# Altium schematic sheet ETH-input.SchDoc: AA Design Challenge (part 2 of 3)
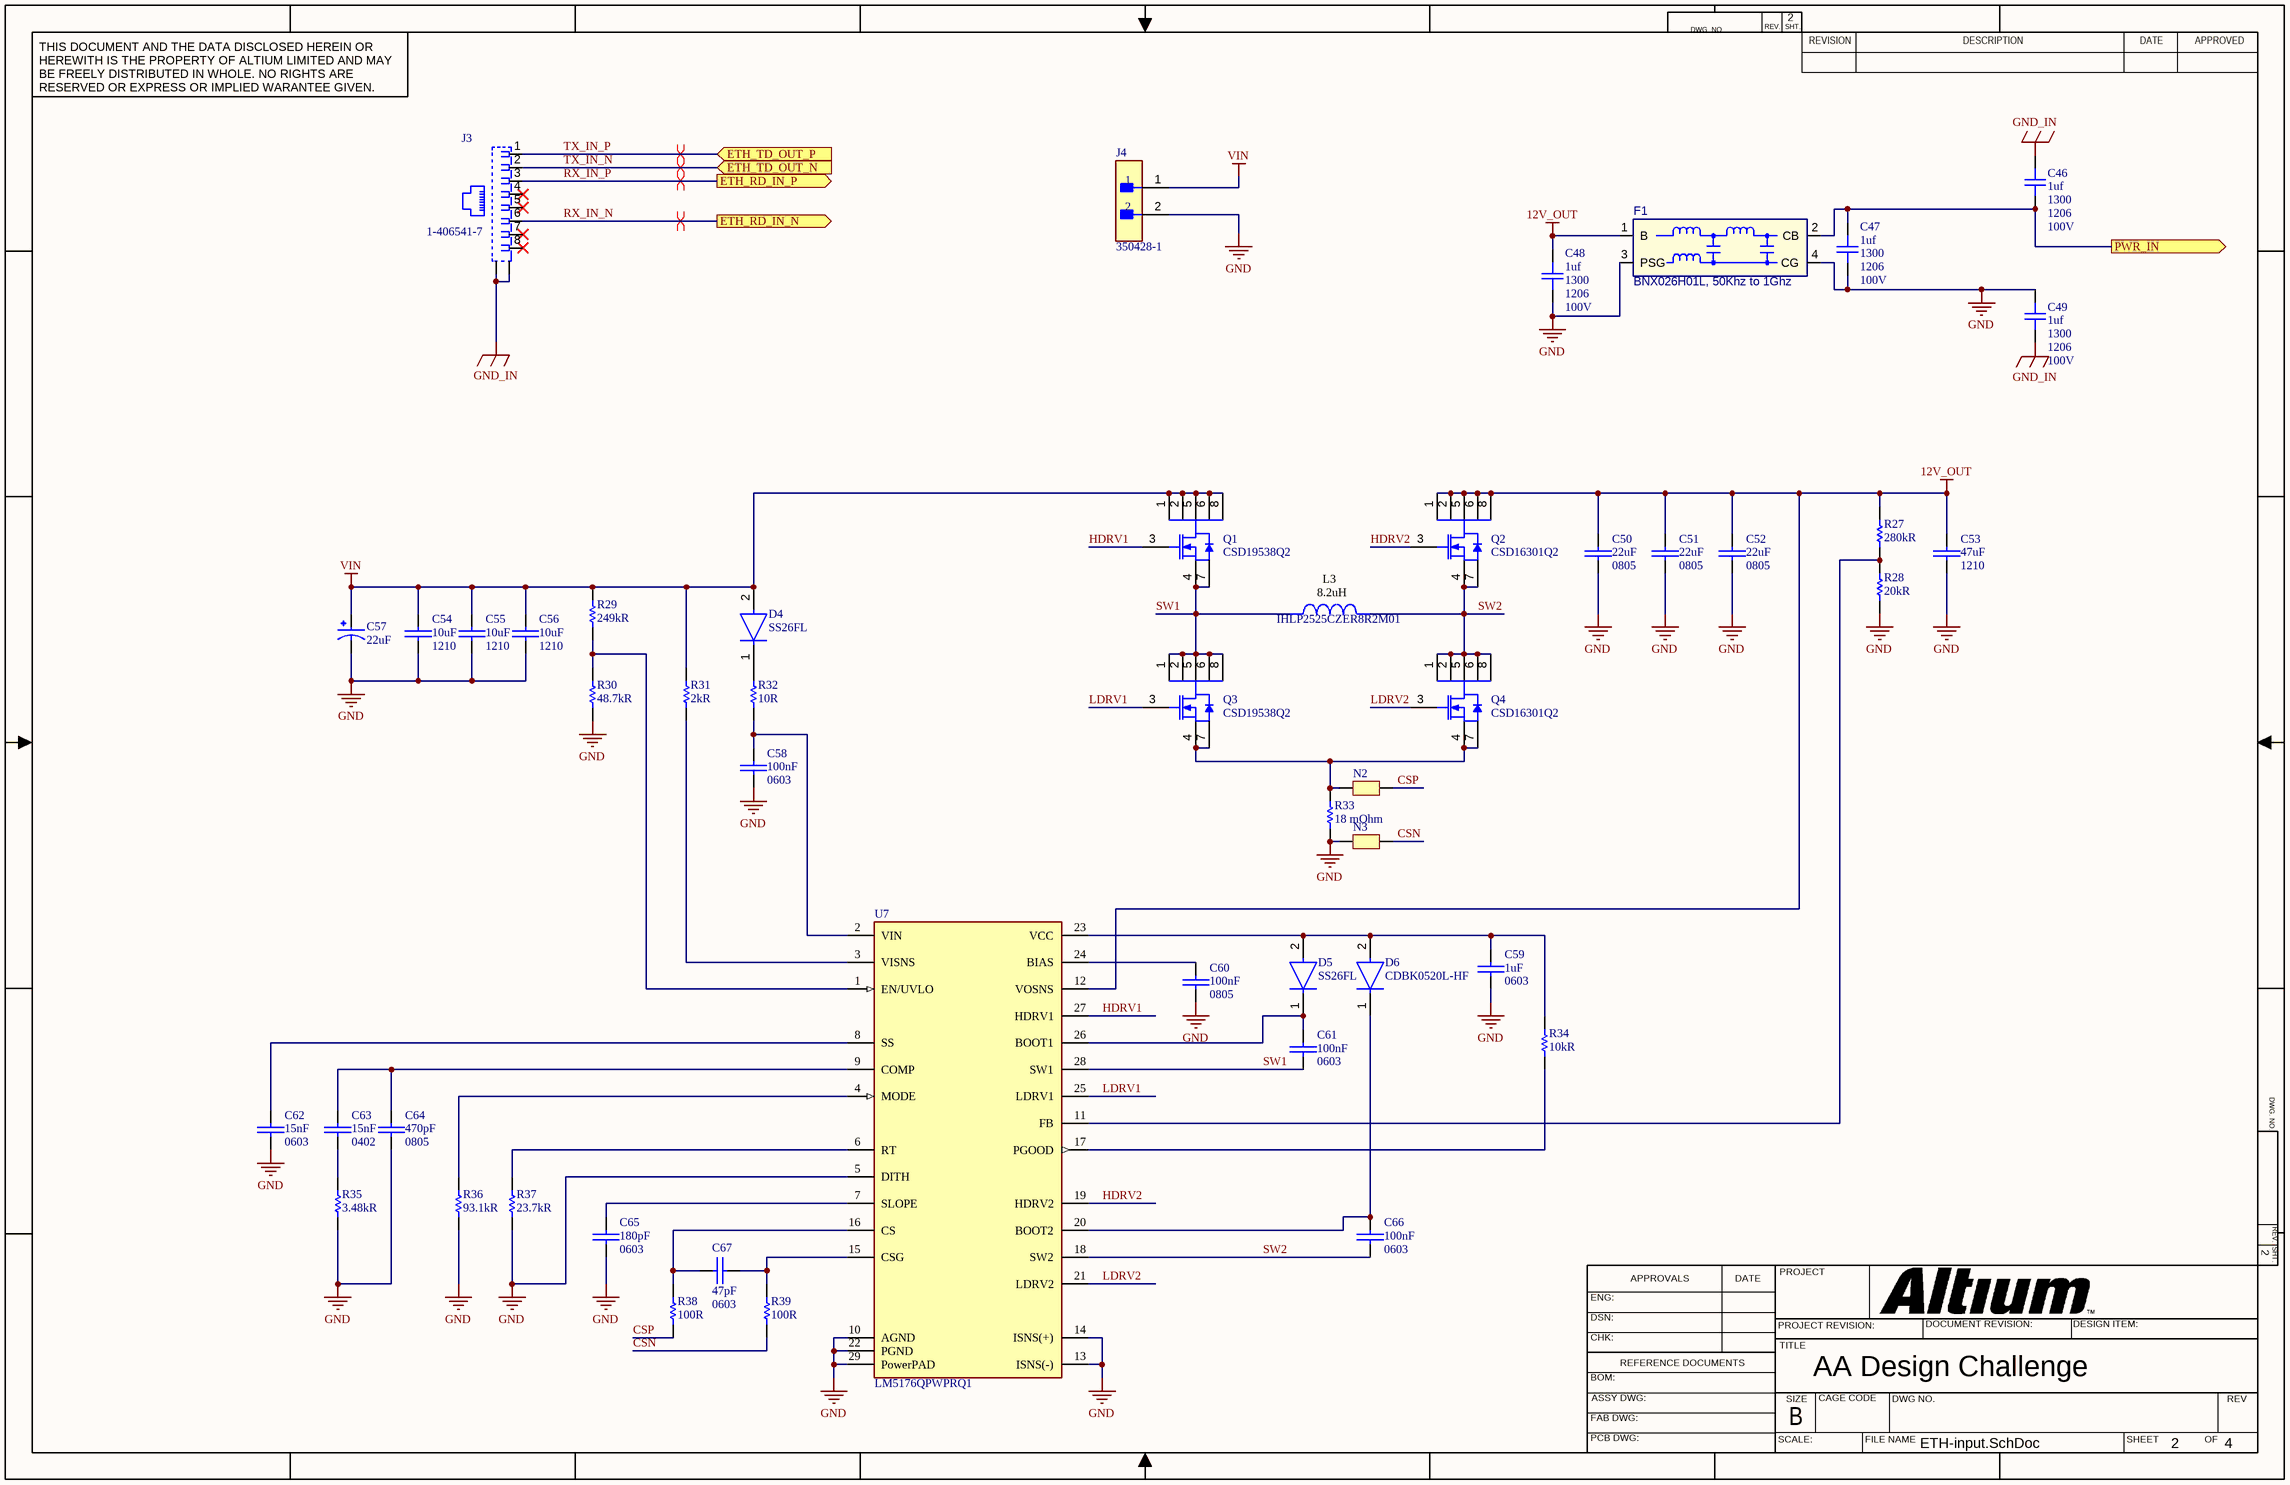
[diagram p1: ETH-input.SchDoc]
## Library data of the parts
C46-C49 = 1300: Capacitor - 1uf 100V 10% X7R 1206; Manufacturer: Samsung Electro-Mechanics; Manufacturer Part Number: CL31B105KCHNNNE; Tolerance: +/-10%; Pacstar PN: 1300; Type: Capacitor; Supplier 1: Digi-Key; Supplier Part Number 1: 1276-1838-1-ND; Supplier 2: Digi-Key; Supplier Part Number 2: 587-1777-1-ND; Supplier 3: Digi-Key; Supplier Part Number 3: 478-6226-1-ND; Status: Bronze; Checked By: xxx; Supplier 4: Arrow Electronics; Supplier 5: Mouser; Supplier Part Number 4: CL31B105KCHNNNE; Supplier Part Number 5: 187-CL31B105KCHNNNE
C50-C52 = CAP CER 10UF 63V X7R 1210: C Series 0805 22 uF 35 V ±20 % Tolerance X5R SMT Multilayer Ceramic Capacitor; Manufacturer: TDK; Manufacturer Part Number: C2012X5R1V226M125AC; Tolerance: 20%; Voltage Rating: 35V; Supplier: Digi-Key; Supplier Part Number: 445-14428-1-ND; RoHS: Yes; Category: Ceramic Capacitors; Stock: 123089; Pricing: 1=0.91000, 10=0.68900, 50=0.57260, 100=0.49310, 500=0.38178, 1000=0.32876 (USD); Mounting Technology: Surface Mount; Case Code (Metric): 2012; Case Code (Imperial): 0805; Weight: 0.000194oz; Dielectric Material: Ceramic; Min Operating Temperature: -55°C; Max Operating Temperature: 85°C; Package Quantity: 1; Packaging: Tape and Reel; Value: 22uF; Dielectric: X5R; Termination: SMD/SMT; Voltage Rating (DC): 35V; Series: C; Length: 0.079inch; Width: 0.049inch; Height: 1.25mm; Thickness: 0.057inch; Reach SVHC Compliant: No; Lead Free: Lead Free; RoHS Compliant: Yes; ComponentLink1URL: https://datasheet.ciiva.com/14893/tdkmlcccaprange-14893109.pdf?src-supplier=Digi-Key; ComponentLink1Description: https://datasheet.ciiva.com/14893/tdkmlcccaprange-14893109.pdf?src-supplier=Digi-Key; ComponentLink2URL: https://datasheet.ciiva.com/14893/tdkmlcccaprange-14893110.pdf?src-supplier=Digi-Key; ComponentLink2Description: https://datasheet.ciiva.com/14893/tdkmlcccaprange-14893110.pdf?src-supplier=Digi-Key; ComponentLink3URL: https://datasheet.ciiva.com/14893/tdkmlcccaprange-14893111.pdf?src-supplier=Digi-Key; ComponentLink3Description: https://datasheet.ciiva.com/14893/tdkmlcccaprange-14893111.pdf?src-supplier=Digi-Key
C53 = CAP CER 10UF 63V X7R 1210: 1210 47 uF 16 V ±10% Tolerance X5R SMT Multilayer Ceramic Capacitor; Manufacturer: Samsung Electro-Mechanics; Manufacturer Part Number: CL32A476KOJNNNE; Voltage Rating: 16V; Supplier: Digi-Key; Supplier Part Number: 490-6539-1-ND; RoHS: Yes; Category: Ceramic Capacitors; Stock: 395667; Pricing: 1=1.07000, 10=0.84800, 50=0.73520, 100=0.63630, 500=0.48076 (USD); Mounting Technology: Surface Mount; Pins: 2; Case Code (Metric): 3225; Case Code (Imperial): 1210; Material: Ceramic; Min Operating Temperature: -55°C; Max Operating Temperature: 85°C; Value: 47uF; Tolerance: 10%; Dielectric: X5R; Voltage Rating (DC): 16V; Packaging: Cut Tape; Package Quantity: 1; Termination: SMD/SMT; Voltage: 16V; Series: GRM; Construction: Flat; Length: 3.2mm; Width: 0.098inch; Height: 2.5mm; Thickness: 0.106inch; Depth: 2.5mm; Radiation Hardening: No; Reach SVHC Compliant: No; Lead Free: Lead Free; RoHS Compliant: Yes; ComponentLink1URL: https://datasheet.ciiva.com/6173/1747491-6173112.pdf?src-supplier=Farnell; ComponentLink1Description: https://datasheet.ciiva.com/6173/1747491-6173112.pdf?src-supplier=Farnell; ComponentLink2URL: https://datasheet.ciiva.com/6264/c02e-6264496.pdf?src-supplier=Digi-Key; ComponentLink2Description: https://datasheet.ciiva.com/6264/c02e-6264496.pdf?src-supplier=Digi-Key; ComponentLink3URL: https://datasheet.ciiva.com/5411/product-5411296.pdf?src-supplier=Mouser; ComponentLink3Description: https://datasheet.ciiva.com/5411/product-5411296.pdf?src-supplier=Mouser; ComponentLink4URL: https://datasheet.ciiva.com/29202/451184-da-01-de-vs-chip-kond-1210-47-0-uf-10pr-16-0v-x5r-29202483.pdf?src-supplier=Conrad; ComponentLink4Description: https://datasheet.ciiva.com/29202/451184-da-01-de-vs-chip-kond-1210-47-0-uf-10pr-16-0v-x5r-29202483.pdf?src-supplier=Conrad; ComponentLink5URL: https://datasheet.ciiva.com/29201/451871-da-01-de-vs-kondens-grm32-er61c-476ke15l-29201820.pdf?src-supplier=Conrad; ComponentLink5Description: https://datasheet.ciiva.com/29201/451871-da-01-de-vs-kondens-grm32-er61c-476ke15l-29201820.pdf?src-supplier=Conrad; ComponentLink6URL: https://datasheet.ciiva.com/6264/partnumbering-e-01-6264495.pdf?src-supplier=Digi-Key; ComponentLink6Description: https://datasheet.ciiva.com/6264/partnumbering-e-01-6264495.pdf?src-supplier=Digi-Key; ComponentLink7URL: https://datasheet.ciiva.com/16497/product-16497029.pdf?src-supplier=Future+Electronics; ComponentLink7Description: https://datasheet.ciiva.com/16497/product-16497029.pdf?src-supplier=Future+Electronics
C54-C56 = CAP CER 10UF 63V X7R 1210: Multilayer Ceramic Capacitors MLCC - SMD/SMT 1210 10uF 63volts *Derate Voltage/Temp; Manufacturer: Samsung Electro-Mechanics; Manufacturer Part Number: CL32B106KMVNNWE; Tolerance: 10%; Dielectric: X7R; Voltage Rating: 63V; Supplier: Digi-Key; Supplier Part Number: 1276-7053-1-ND; RoHS: Yes; Category: Ceramic Capacitors; Stock: 235653; Pricing: 1=0.88000, 10=0.66600, 50=0.55360, 100=0.47670, 500=0.36906 (USD); Mounting Technology: Surface Mount; Case Code (Metric): 3225; Material: Ceramic; Case Code (Imperial): 1210; Weight: 0.00388oz; Dielectric Material: Ceramic; Min Operating Temperature: -55°C; Max Operating Temperature: 125°C; Packaging: Tape and Reel; Voltage: 63V; Termination: SMD/SMT; Voltage Rating (DC): 63V; Package Quantity: 1000; Value: 10uF; Series: GRM; Length: 3.2mm; Width: 2.5mm; Height: 2.5mm; Thickness: 0.106inch; Depth: 2.5mm; Reach SVHC Compliant: No; Lead Free: Lead Free; RoHS Compliant: Yes; ComponentLink1URL: http://www.farnell.com/datasheets/2079202.pdf?src-supplier=Farnell; ComponentLink1Description: http://www.farnell.com/datasheets/2079202.pdf?src-supplier=Farnell; ComponentLink2URL: http://www.mouser.com/ds/2/281/c02e-2905.pdf?src-supplier=Mouser; ComponentLink2Description: http://www.mouser.com/ds/2/281/c02e-2905.pdf?src-supplier=Mouser; ComponentLink3URL: http://www.farnell.com/datasheets/2079202.pdf?src-supplier=Element14; ComponentLink3Description: http://www.farnell.com/datasheets/2079202.pdf?src-supplier=Element14; ComponentLink4URL: http://search.murata.co.jp/Ceramy/image/img/A01X/G101/ENG/GRM32ER71J106KA12-01.pdf?src-supplier=Digi-Key; ComponentLink4Description: http://search.murata.co.jp/Ceramy/image/img/A01X/G101/ENG/GRM32ER71J106KA12-01.pdf?src-supplier=Digi-Key; ComponentLink5URL: http://www.farnell.com/datasheets/2079202.pdf?src-supplier=Newark; ComponentLink5Description: http://www.farnell.com/datasheets/2079202.pdf?src-supplier=Newark; ComponentLink6URL: http://psearch.en.murata.com/capacitor/product/GRM32ER71J106KA12%23.pdf?src-supplier=Avnet; ComponentLink6Description: http://psearch.en.murata.com/capacitor/product/GRM32ER71J106KA12%23.pdf?src-supplier=Avnet
C57 = EEEHC1H220XP: 22ÂµF 50V Aluminum Electrolytic Capacitors Radial, Can - SMD 3000 Hrs @ 105Â°C; Manufacturer: Panasonic; Package: RADIAL-2 Panasonic; Price: None; Value: *; SnapEDA_Link: https://www.snapeda.com/parts/EEEHC1H220XP/Panasonic/view-part/?ref=snap; Manufacturer Part Number: EEEHC1H220XP; Availability: Not in stock; Check_prices: https://www.snapeda.com/parts/EEEHC1H220XP/Panasonic/view-part/?ref=eda
C58 = CAP CER 10UF 63V X7R 1210: CGA Series 0603 100 nF 50 V ±10 % Tolerance X7R SMT Multilayer Ceramic Capacitor; Manufacturer: TDK; Manufacturer Part Number: CGA3E2X7R1H104K080AA; Tolerance: 10%; Voltage Rating (DC): 50V; Supplier: Digi-Key; Supplier Part Number: 445-5666-1-ND; RoHS: Yes; Category: Ceramic Capacitors; Stock: 7571751; Pricing: 1=0.10000, 10=0.06700, 50=0.03640, 100=0.02970, 500=0.02120, 1000=0.01666 (USD); Mounting Technology: Surface Mount; Case Code (Imperial): 0603; Case Code (Metric): 1608; Weight: 7.1E-05oz; Min Operating Temperature: -55°C; Max Operating Temperature: 125°C; Value: 100nF; Packaging: Tape and Reel; Dielectric: X7R; Package Quantity: 1; Voltage Rating: 50V; Termination: SMD/SMT; Voltage: 50V; Series: CGA; Length: 1.6mm; Width: 0.031inch; Height: 0.8mm; Depth: 0.8mm; Thickness: 0.035inch; Ratings: AEC-Q200; Radiation Hardening: No; Lead Free: Lead Free; RoHS Compliant: Yes; Reach SVHC Compliant: No; ComponentLink1URL: https://datasheet.ciiva.com/24216/cga3e2x7r1h104k080aa-266291-24216208.pdf?src-supplier=Mouser; ComponentLink1Description: https://datasheet.ciiva.com/24216/cga3e2x7r1h104k080aa-266291-24216208.pdf?src-supplier=Mouser; ComponentLink2URL: https://datasheet.ciiva.com/15192/getdatasheetpartid-715867-15192412.pdf?src-supplier=Verical; ComponentLink2Description: https://datasheet.ciiva.com/15192/getdatasheetpartid-715867-15192412.pdf?src-supplier=Verical; ComponentLink3URL: https://datasheet.ciiva.com/23803/1936565-23803084.pdf?src-supplier=Newark; ComponentLink3Description: https://datasheet.ciiva.com/23803/1936565-23803084.pdf?src-supplier=Newark; ComponentLink4URL: https://datasheet.ciiva.com/22725/1735392-22725642.pdf?src-supplier=Element14; ComponentLink4Description: https://datasheet.ciiva.com/22725/1735392-22725642.pdf?src-supplier=Element14; ComponentLink5URL: https://datasheet.ciiva.com/46385/1735392-46385708.pdf?src-supplier=Element14; ComponentLink5Description: https://datasheet.ciiva.com/46385/1735392-46385708.pdf?src-supplier=Element14; ComponentLink6URL: https://datasheet.ciiva.com/16500/mlccspec-automotive-general-midvoltage-en-16500693.pdf?src-supplier=Future+Electronics; ComponentLink6Description: https://datasheet.ciiva.com/16500/mlccspec-automotive-general-midvoltage-en-16500693.pdf?src-supplier=Future+Electronics
C59 = CAP CER 10UF 63V X7R 1210: 0603 1 uF 16 V ±10% Tolerance X7R SMT Multilayer Ceramic Capacitor; Manufacturer: Samsung Electro-Mechanics; Manufacturer Part Number: CL10B105KO8NNNC; Voltage Rating: 16V; Supplier: Digi-Key; Supplier Part Number: 587-1241-1-ND; RoHS: Yes; Category: Ceramic Capacitors; Stock: 2153377; Pricing: 1=0.10000, 10=0.07000, 50=0.03820, 100=0.03120, 500=0.02228, 1000=0.01750 (USD); Mounting Technology: Surface Mount; Pins: 2; Case Code (Metric): 1608; Case Code (Imperial): 0603; Min Operating Temperature: -55°C; Max Operating Temperature: 125°C; Package Quantity: 1; Value: 1uF; Tolerance: 10%; Packaging: Tape and Reel; Voltage Rating (DC): 16V; Dielectric: X7R; Termination: SMD/SMT; Series: M; Construction: Flat; Length: 1.6mm; Width: 0.031inch; Height: 0.8mm; Thickness: 0.035inch; Depth: 0.8mm; Radiation Hardening: No; Lead Free: Lead Free; RoHS Compliant: Yes; Reach SVHC Compliant: No; Halogen Free: Halogen Free; ComponentLink1URL: https://datasheet.ciiva.com/5815/1697718-5815968.pdf?src-supplier=Farnell; ComponentLink1Description: https://datasheet.ciiva.com/5815/1697718-5815968.pdf?src-supplier=Farnell; ComponentLink2URL: https://datasheet.ciiva.com/132/emk107b7105ka-t-ss-132544.pdf?src-supplier=Digi-Key; ComponentLink2Description: https://datasheet.ciiva.com/132/emk107b7105ka-t-ss-132544.pdf?src-supplier=Digi-Key; ComponentLink3URL: https://datasheet.ciiva.com/30212/193emk107b7105ka-t-30212019.pdf?src-supplier=Onlinecomponents.com; ComponentLink3Description: https://datasheet.ciiva.com/30212/193emk107b7105ka-t-30212019.pdf?src-supplier=Onlinecomponents.com; ComponentLink4URL: https://datasheet.ciiva.com/15920/966emk107b7105ka-t-15920470.pdf?src-supplier=Onlinecomponents.com; ComponentLink4Description: https://datasheet.ciiva.com/15920/966emk107b7105ka-t-15920470.pdf?src-supplier=Onlinecomponents.com; ComponentLink5URL: https://datasheet.ciiva.com/26871/getdatasheetpartid-637486-26871306.pdf?src-supplier=Verical; ComponentLink5Description: https://datasheet.ciiva.com/26871/getdatasheetpartid-637486-26871306.pdf?src-supplier=Verical; ComponentLink6URL: https://datasheet.ciiva.com/30137/126emk107b7105ka-t-30137199.pdf?src-supplier=Onlinecomponents.com; ComponentLink6Description: https://datasheet.ciiva.com/30137/126emk107b7105ka-t-30137199.pdf?src-supplier=Onlinecomponents.com; ComponentLink7URL: https://datasheet.ciiva.com/7975/746258-7975612.pdf?src-supplier=Element14; ComponentLink7Description: https://datasheet.ciiva.com/7975/746258-7975612.pdf?src-supplier=Element14; ComponentLink8URL: https://datasheet.ciiva.com/7657/1697718-7657322.pdf?src-supplier=Element14; ComponentLink8Description: https://datasheet.ciiva.com/7657/1697718-7657322.pdf?src-supplier=Element14
C60 = CAP CER 10UF 63V X7R 1210: 0805 100 nF 25V ±10 % Tolerance X7R Surface Mount Multilayer Ceramic Capacitor; Manufacturer: Kyocera AVX; Manufacturer Part Number: 08053C104KAT2A; Tolerance: 10%; Insulation Resistance: 100GR; Dissipation Factor: 3%; Supplier: Digi-Key; Supplier Part Number: 478-3755-1-ND; RoHS: Yes; Category: Ceramic Capacitors; Stock: 793433; Pricing: 1=0.10000, 10=0.06100, 50=0.03340, 100=0.02730, 500=0.01948, 1000=0.01530 (USD); Mounting Technology: Surface Mount,PCB; Pins: 2; Case Code (Imperial): 0805; Case Code (Metric): 2012; Min Operating Temperature: -55°C; Max Operating Temperature: 125°C; Value: 100nF; Dielectric: X7R; Packaging: Tape and Reel; Voltage Rating (DC): 25V; Voltage: 25V; Voltage Rating: 25V; Package Quantity: 4000; Termination: SMD/SMT; Series: -; Construction: Flat; Length: 2.01mm; Width: 0.008inch; Height: 0.94mm; Depth: 1.25mm; Thickness: 0.037inch; Radiation Hardening: No; Reach SVHC Compliant: No; Lead Free: Lead Free; RoHS Compliant: Yes; ComponentLink1URL: https://datasheet.ciiva.com/11786/0900766b80ed4be2-11786193.pdf?src-supplier=Rs; ComponentLink1Description: https://datasheet.ciiva.com/11786/0900766b80ed4be2-11786193.pdf?src-supplier=Rs; ComponentLink2URL: https://datasheet.ciiva.com/150/cx7r-150317.pdf?src-supplier=Digi-Key; ComponentLink2Description: https://datasheet.ciiva.com/150/cx7r-150317.pdf?src-supplier=Digi-Key; ComponentLink3URL: https://datasheet.ciiva.com/150/cx7r-150318.pdf?src-supplier=Digi-Key; ComponentLink3Description: https://datasheet.ciiva.com/150/cx7r-150318.pdf?src-supplier=Digi-Key; ComponentLink4URL: https://datasheet.ciiva.com/150/cx7r-150319.pdf?src-supplier=Digi-Key; ComponentLink4Description: https://datasheet.ciiva.com/150/cx7r-150319.pdf?src-supplier=Digi-Key; ComponentLink5URL: https://datasheet.ciiva.com/11462/cx7r-11462779.pdf?src-supplier=Avnet; ComponentLink5Description: https://datasheet.ciiva.com/11462/cx7r-11462779.pdf?src-supplier=Avnet; ComponentLink6URL: https://datasheet.ciiva.com/5416/cx7r-5416971.pdf?src-supplier=Mouser; ComponentLink6Description: https://datasheet.ciiva.com/5416/cx7r-5416971.pdf?src-supplier=Mouser; ComponentLink7URL: https://datasheet.ciiva.com/2987/cx7r-2987955.pdf?src-supplier=Avnet; ComponentLink7Description: https://datasheet.ciiva.com/2987/cx7r-2987955.pdf?src-supplier=Avnet; ComponentLink8URL: https://datasheet.ciiva.com/14596/70001075-14596006.pdf?src-supplier=Allied+Electronics; ComponentLink8Description: https://datasheet.ciiva.com/14596/70001075-14596006.pdf?src-supplier=Allied+Electronics; ComponentLink9URL: https://datasheet.ciiva.com/7811/cx7r-7811991.pdf?src-supplier=Element14; ComponentLink9Description: https://datasheet.ciiva.com/7811/cx7r-7811991.pdf?src-supplier=Element14; ComponentLink10URL: https://datasheet.ciiva.com/7811/cx7r-7811992.pdf?src-supplier=Element14; ComponentLink10Description: https://datasheet.ciiva.com/7811/cx7r-7811992.pdf?src-supplier=Element14; ComponentLink11URL: https://datasheet.ciiva.com/7811/cx7r-7811990.pdf?src-supplier=Element14; ComponentLink11Description: https://datasheet.ciiva.com/7811/cx7r-7811990.pdf?src-supplier=Element14
C61 C66 = CAP CER 10UF 63V X7R 1210: Cap Ceramic 0.1uF 25V X7R 10% SMD 0603 125 Paper T/R; Manufacturer: Kyocera AVX; Manufacturer Part Number: 06033C104KAT2A; Supplier: Digi-Key; Supplier Part Number: 478-3714-1-ND; RoHS: Yes; Category: Ceramic Capacitors; Stock: 1816230; Pricing: 1=0.10000, 10=0.03900, 50=0.02120, 100=0.01730, 500=0.01238, 1000=0.00972 (USD); Mounting Technology: Surface Mount,PCB; Pins: 2; Case Code (Metric): 1608; Case Code (Imperial): 0603; Min Operating Temperature: -55°C; Max Operating Temperature: 125°C; Tolerance: 10%; Value: 100nF; Dielectric: X7R; Packaging: Tape and Reel; Voltage Rating (DC): 25V; Voltage: 25V; Voltage Rating: 25V; Package Quantity: 4000; Termination: SMD/SMT; Series: -; Construction: Flat; Length: 1.6mm; Width: 0.81mm; Height: 0.9mm; Depth: 0.81mm; Reach SVHC Compliant: No; Lead Free: Lead Free; RoHS Compliant: Yes; ComponentLink1URL: https://datasheet.ciiva.com/36526/1929031-36526214.pdf?src-supplier=Jameco; ComponentLink1Description: https://datasheet.ciiva.com/36526/1929031-36526214.pdf?src-supplier=Jameco; ComponentLink2URL: https://datasheet.ciiva.com/16199/cx7r-16199096.pdf?src-supplier=Future+Electronics; ComponentLink2Description: https://datasheet.ciiva.com/16199/cx7r-16199096.pdf?src-supplier=Future+Electronics; ComponentLink3URL: https://datasheet.ciiva.com/7855/cx7r-7855214.pdf?src-supplier=Element14; ComponentLink3Description: https://datasheet.ciiva.com/7855/cx7r-7855214.pdf?src-supplier=Element14; ComponentLink4URL: https://datasheet.ciiva.com/7855/1679506-7855046.pdf?src-supplier=Element14; ComponentLink4Description: https://datasheet.ciiva.com/7855/1679506-7855046.pdf?src-supplier=Element14; ComponentLink5URL: https://datasheet.ciiva.com/152/cx7r-152389.pdf?src-supplier=Digi-Key; ComponentLink5Description: https://datasheet.ciiva.com/152/cx7r-152389.pdf?src-supplier=Digi-Key; ComponentLink6URL: https://datasheet.ciiva.com/152/cx7r-152388.pdf?src-supplier=Digi-Key; ComponentLink6Description: https://datasheet.ciiva.com/152/cx7r-152388.pdf?src-supplier=Digi-Key; ComponentLink7URL: https://datasheet.ciiva.com/152/cx7r-152390.pdf?src-supplier=Digi-Key; ComponentLink7Description: https://datasheet.ciiva.com/152/cx7r-152390.pdf?src-supplier=Digi-Key; ComponentLink8URL: https://datasheet.ciiva.com/14590/70001075-14590200.pdf?src-supplier=Allied+Electronics; ComponentLink8Description: https://datasheet.ciiva.com/14590/70001075-14590200.pdf?src-supplier=Allied+Electronics; ComponentLink9URL: https://datasheet.ciiva.com/14598/70001075-14598246.pdf?src-supplier=Allied+Electronics; ComponentLink9Description: https://datasheet.ciiva.com/14598/70001075-14598246.pdf?src-supplier=Allied+Electronics
C62 = CAP CER 10UF 63V X7R 1210: 0603 C 15nF Ceramic Multilayer Capacitor; 25 V; +125degC; C0G Dielectric; +/-5%; Manufacturer: KEMET; Manufacturer Part Number: C0603C153J3GACTU; Tolerance: 5%; Voltage Rating: 25V; Temperature Coefficient: 30ppm/°C; Dissipation Factor: 0.1%; Supplier: Digi-Key; Supplier Part Number: 399-C0603C153J3GAC7867CT-ND; RoHS: Yes; Category: Ceramic Capacitors; Stock: 13854; Pricing: 1=0.38000, 10=0.26500, 50=0.18560, 100=0.15910, 500=0.11930, 1000=0.10075 (USD); Mounting Technology: Surface Mount; Pins: 2; Case Code (Metric): 1608; Case Code (Imperial): 0603; Dielectric Material: Ceramic; Min Operating Temperature: -55°C; Max Operating Temperature: 125°C; Value: 15nF; Packaging: Tape and Reel; Package Quantity: 1; Voltage Rating (DC): 25V; Dielectric: C0G; Termination: SMD/SMT; Voltage: 25V; Series: C; Construction: Flat; Length: 1.6mm; Width: 0.8mm; Height: 0.8mm; Thickness: 0.034inch; Depth: 0.8mm; Radiation Hardening: No; Reach SVHC Compliant: No; Lead Free: Lead Free; RoHS Compliant: Yes; ComponentLink1URL: https://datasheet.ciiva.com/5423/kem-c1003-c0g-smd-356956-5423902.pdf?src-supplier=Mouser; ComponentLink1Description: https://datasheet.ciiva.com/5423/kem-c1003-c0g-smd-356956-5423902.pdf?src-supplier=Mouser; ComponentLink2URL: https://datasheet.ciiva.com/11664/kem-c1003-c0g-smd-11664299.pdf?src-supplier=Avnet; ComponentLink2Description: https://datasheet.ciiva.com/11664/kem-c1003-c0g-smd-11664299.pdf?src-supplier=Avnet; ComponentLink3URL: https://datasheet.ciiva.com/7823/10895-7823644.pdf?src-supplier=Element14; ComponentLink3Description: https://datasheet.ciiva.com/7823/10895-7823644.pdf?src-supplier=Element14; ComponentLink4URL: https://datasheet.ciiva.com/7823/10895-7823645.pdf?src-supplier=Element14; ComponentLink4Description: https://datasheet.ciiva.com/7823/10895-7823645.pdf?src-supplier=Element14
C63 = CAP CER 10UF 63V X7R 1210: Cap Ceramic 0.015uF 50V X7R 10% SMD 0402 125°C Punched Paper T/R; Manufacturer: TDK; Manufacturer Part Number: CGA2B3X7R1H153K050BB; Supplier: Digi-Key; Supplier Part Number: 445-6894-1-ND; RoHS: Yes; Category: Ceramic Capacitors; Stock: 5055; Pricing: 1=0.10000, 10=0.06700, 50=0.03640, 100=0.02970, 500=0.02120, 1000=0.01666, 2500=0.01515, 5000=0.01394 (USD); Mounting Technology: Surface Mount; Case Code (Metric): 1005; Case Code (Imperial): 0402; Weight: 2.3E-05oz; Min Operating Temperature: -55°C; Max Operating Temperature: 125°C; Value: 15nF; Tolerance: 10%; Voltage Rating: 50V; Packaging: Tape and Reel; Dielectric: X7R; Termination: SMD/SMT; Series: CGA; Package Quantity: 10000; Voltage Rating (DC): 50V; Length: 1mm; Width: 0.5mm; Height: 0.5mm; Depth: 0.5mm; Ratings: AEC-Q200; RoHS Compliant: Yes; Reach SVHC Compliant: No; ComponentLink1URL: https://datasheet.ciiva.com/24216/cga2b3x7r1h153k050bb-265753-24216936.pdf?src-supplier=Mouser; ComponentLink1Description: https://datasheet.ciiva.com/24216/cga2b3x7r1h153k050bb-265753-24216936.pdf?src-supplier=Mouser; ComponentLink2URL: https://datasheet.ciiva.com/7975/1807242-7975309.pdf?src-supplier=Element14; ComponentLink2Description: https://datasheet.ciiva.com/7975/1807242-7975309.pdf?src-supplier=Element14
C64 = CAP CER 10UF 63V X7R 1210: CAP CER 470PF 50V C0G/NP0 0805; Manufacturer: Wurth Elektronik; Manufacturer Part Number: 885012007061; Material: Ceramic; Tolerance: 5%; Dielectric: C0G; Temperature Coefficient: 300ppm/°C; Supplier: Digi-Key; Supplier Part Number: 1276-1121-1-ND; RoHS: Yes; Category: Ceramic Capacitors; Stock: 2; Pricing: 1=0.10000 (USD); Mounting Technology: Surface Mount; Case Code (Metric): 2012; Case Code (Imperial): 0805; Min Operating Temperature: -55°C; Max Operating Temperature: 125°C; Package Quantity: 1; Packaging: Tape and Reel; Value: 470pF; Voltage Rating: 50V; Voltage: 50V; Series: CL; Voltage Rating (DC): 50V; Length: 2mm; Width: 0.049inch; Height: 0.65mm; Thickness: 0.03inch; Depth: 1.25mm; Radiation Hardening: No; RoHS Compliant: Yes; Lead Free: Lead Free; ComponentLink1URL: https://datasheet.ciiva.com/25800/cl21c471jbannnc-25800432.pdf?src-supplier=Digi-Key; ComponentLink1Description: https://datasheet.ciiva.com/25800/cl21c471jbannnc-25800432.pdf?src-supplier=Digi-Key; ComponentLink2URL: https://datasheet.ciiva.com/26838/getdatasheetpartid-481551-26838808.pdf?src-supplier=Verical; ComponentLink2Description: https://datasheet.ciiva.com/26838/getdatasheetpartid-481551-26838808.pdf?src-supplier=Verical; ComponentLink3URL: https://datasheet.ciiva.com/29200/453567-da-01-en-vs-kondensator-0805-29200120.pdf?src-supplier=Conrad; ComponentLink3Description: https://datasheet.ciiva.com/29200/453567-da-01-en-vs-kondensator-0805-29200120.pdf?src-supplier=Conrad; ComponentLink4URL: https://datasheet.ciiva.com/26310/mlcc-catalogdownload2013-eng-26310239.pdf?src-supplier=Distrelec; ComponentLink4Description: https://datasheet.ciiva.com/26310/mlcc-catalogdownload2013-eng-26310239.pdf?src-supplier=Distrelec; ComponentLink5URL: https://datasheet.ciiva.com/16393/cl05b104kq5nnnc-16393422.pdf?src-supplier=Future+Electronics; ComponentLink5Description: https://datasheet.ciiva.com/16393/cl05b104kq5nnnc-16393422.pdf?src-supplier=Future+Electronics
C65 = CAP CER 10UF 63V X7R 1210: Surface Mount Ceramic Multilayer Capacitor 180pF 5% C0G 50V 0603 Paper T/R; Manufacturer: Yageo; Manufacturer Part Number: CC0603JRNPO9BN181; Insulation Resistance: 100GR; Supplier: Digi-Key; Supplier Part Number: 311-1072-1-ND; RoHS: Yes; Category: Ceramic Capacitors; Stock: 299906; Pricing: 1=0.10000, 10=0.05500, 50=0.02980, 100=0.02430, 500=0.01740, 1000=0.01367 (USD); Mounting Technology: Surface Mount; Material: Ceramic; Dielectric Material: Ceramic; Case Code (Metric): 1608; Case Code (Imperial): 0603; Min Operating Temperature: -55°C; Max Operating Temperature: 125°C; Value: 180pF; Tolerance: 5%; Dielectric: C0G; Packaging: Tape and Reel; Voltage Rating (DC): 50V; Package Quantity: 1; Termination: SMD/SMT; Series: CC; Voltage Rating: 50V; Length: 1.6mm; Width: 0.031inch; Height: 0.8mm; Thickness: 0.035inch; Depth: 0.8mm; Radiation Hardening: No; Lead Free: Lead Free; RoHS Compliant: Yes; Reach SVHC Compliant: Unknown; ComponentLink1URL: https://datasheet.ciiva.com/7978/1132289-7978133.pdf?src-supplier=Element14; ComponentLink1Description: https://datasheet.ciiva.com/7978/1132289-7978133.pdf?src-supplier=Element14; ComponentLink2URL: https://datasheet.ciiva.com/8033/1443161-8033736.pdf?src-supplier=Element14; ComponentLink2Description: https://datasheet.ciiva.com/8033/1443161-8033736.pdf?src-supplier=Element14; ComponentLink3URL: https://datasheet.ciiva.com/8033/1443161-8033738.pdf?src-supplier=Element14; ComponentLink3Description: https://datasheet.ciiva.com/8033/1443161-8033738.pdf?src-supplier=Element14; ComponentLink4URL: https://datasheet.ciiva.com/176/mlccorderingcode-176406.pdf?src-supplier=Digi-Key; ComponentLink4Description: https://datasheet.ciiva.com/176/mlccorderingcode-176406.pdf?src-supplier=Digi-Key; ComponentLink5URL: https://datasheet.ciiva.com/176/mlccorderingcode-176405.pdf?src-supplier=Digi-Key; ComponentLink5Description: https://datasheet.ciiva.com/176/mlccorderingcode-176405.pdf?src-supplier=Digi-Key; ComponentLink6URL: https://datasheet.ciiva.com/176/mlccorderingcode-176407.pdf?src-supplier=Digi-Key; ComponentLink6Description: https://datasheet.ciiva.com/176/mlccorderingcode-176407.pdf?src-supplier=Digi-Key; ComponentLink7URL: https://datasheet.ciiva.com/5427/upy-gp-np0-16v-to-50v-8-5427755.pdf?src-supplier=Mouser; ComponentLink7Description: https://datasheet.ciiva.com/5427/upy-gp-np0-16v-to-50v-8-5427755.pdf?src-supplier=Mouser; ComponentLink8URL: https://datasheet.ciiva.com/26862/getdatasheetpartid-403527-26862762.pdf?src-supplier=Verical; ComponentLink8Description: https://datasheet.ciiva.com/26862/getdatasheetpartid-403527-26862762.pdf?src-supplier=Verical
C67 = CAP CER 10UF 63V X7R 1210: 0603 47 pF 50 V ±5% Tolerance C0G/NP0 Surface Mount Multilayer Ceramic Capacitor; Manufacturer: Kyocera AVX; Manufacturer Part Number: 06035A470JAT2A; Dielectric: C0G; Voltage Rating (DC): 50V; Temperature Coefficient: 30ppm/°C; Supplier: Digi-Key; Supplier Part Number: 478-1171-1-ND; RoHS: Yes; Category: Ceramic Capacitors; Stock: 359855; Pricing: 1=0.10000, 10=0.04900, 50=0.02660, 100=0.02180, 500=0.01556, 1000=0.01222 (USD); Mounting Technology: Surface Mount; Pins: 2; Case Code (Metric): 1608; Case Code (Imperial): 0603; Min Operating Temperature: -55°C; Max Operating Temperature: 125°C; Tolerance: 5%; Value: 47pF; Packaging: Tape and Reel; Voltage: 50V; Voltage Rating: 50V; Termination: SMD/SMT; Series: -; Length: 1.6mm; Width: 0.8mm; Height: 0.9mm; Depth: 0.81mm; Reach SVHC Compliant: No; Lead Free: Lead Free; RoHS Compliant: Yes; ComponentLink1URL: https://datasheet.ciiva.com/11786/0900766b802d4697-11786631.pdf?src-supplier=Rs; ComponentLink1Description: https://datasheet.ciiva.com/11786/0900766b802d4697-11786631.pdf?src-supplier=Rs; ComponentLink2URL: https://datasheet.ciiva.com/16327/ccog-16327110.pdf?src-supplier=Future+Electronics; ComponentLink2Description: https://datasheet.ciiva.com/16327/ccog-16327110.pdf?src-supplier=Future+Electronics; ComponentLink3URL: https://datasheet.ciiva.com/2987/ccog-2987803.pdf?src-supplier=Avnet; ComponentLink3Description: https://datasheet.ciiva.com/2987/ccog-2987803.pdf?src-supplier=Avnet; ComponentLink4URL: https://datasheet.ciiva.com/7855/759117-7855071.pdf?src-supplier=Element14; ComponentLink4Description: https://datasheet.ciiva.com/7855/759117-7855071.pdf?src-supplier=Element14; ComponentLink5URL: https://datasheet.ciiva.com/150/ccog-150297.pdf?src-supplier=Digi-Key; ComponentLink5Description: https://datasheet.ciiva.com/150/ccog-150297.pdf?src-supplier=Digi-Key; ComponentLink6URL: https://datasheet.ciiva.com/150/ccog-150296.pdf?src-supplier=Digi-Key; ComponentLink6Description: https://datasheet.ciiva.com/150/ccog-150296.pdf?src-supplier=Digi-Key; ComponentLink7URL: https://datasheet.ciiva.com/150/ccog-150298.pdf?src-supplier=Digi-Key; ComponentLink7Description: https://datasheet.ciiva.com/150/ccog-150298.pdf?src-supplier=Digi-Key; ComponentLink8URL: https://datasheet.ciiva.com/1124/759117-1124785.pdf?src-supplier=Element14; ComponentLink8Description: https://datasheet.ciiva.com/1124/759117-1124785.pdf?src-supplier=Element14; ComponentLink9URL: https://datasheet.ciiva.com/1124/759117-1124784.pdf?src-supplier=Element14; ComponentLink9Description: https://datasheet.ciiva.com/1124/759117-1124784.pdf?src-supplier=Element14
D4 D5 = d7152d700b627762746794eb795d46e: DIODE SCHOTTKY 60V 2A SOD123F; Manufacturer: ON Semiconductor / Fairchild; Reverse Recovery Time: 8.26ns; Element Configuration: Single; Max Forward Surge Current (Ifsm): 50A; Supplier: Digi-Key; Supplier Part Number: SS26FLCT-ND; Manufacturer Part Number: SS26FL; RoHS: Yes; Category: Schottky Diodes; Stock: 57278; Pricing: 1=0.47000, 10=0.35600, 100=0.22200, 500=0.15190, 1000=0.11684 (USD); Mounting Technology: Surface Mount; Case/Package: SOD; Weight: 0.0276g; Packaging: Cut Tape; Average Rectified Current: 2A; Max Repetitive Reverse Voltage (Vrrm): 60V; Max Reverse Voltage (DC): 60V; Series: Automotive, AEC-Q101; RoHS Compliant: Yes; ComponentLink1URL: http://www.farnell.com/datasheets/2552652.pdf?src-supplier=Farnell; ComponentLink1Description: http://www.farnell.com/datasheets/2552652.pdf?src-supplier=Farnell; ComponentLink2URL: http://www.farnell.com/datasheets/2552652.pdf?src-supplier=Element14; ComponentLink2Description: http://www.farnell.com/datasheets/2552652.pdf?src-supplier=Element14; ComponentLink3URL: http://www.farnell.com/datasheets/2552652.pdf?src-supplier=Newark; ComponentLink3Description: http://www.farnell.com/datasheets/2552652.pdf?src-supplier=Newark; ComponentLink4URL: https://www.fairchildsemi.com/datasheets/SS/SS24FL.pdf?src-supplier=Digi-Key; ComponentLink4Description: https://www.fairchildsemi.com/datasheets/SS/SS24FL.pdf?src-supplier=Digi-Key; ComponentLink5URL: https://datasheet.octopart.com/SS26FL-ON-Semiconductor-datasheet-136429742.pdf?src-supplier=TME; ComponentLink5Description: https://datasheet.octopart.com/SS26FL-ON-Semiconductor-datasheet-136429742.pdf?src-supplier=TME
D6 = d7152d700b627762746794eb795d46e: DIODE SCHOTTKY 20V 500MA SOD123F; Manufacturer: Nexperia; Manufacturer Part Number: PMEG2005EH,115; Reverse Recovery Time: 22ns; Supplier: Digi-Key; Supplier Part Number: CDBK0520L-HF-ND; RoHS: Yes; Category: Rectifier Diodes; Mounting Technology: Surface Mount; Packaging: Tape and Reel; Average Rectified Current: 500mA; Max Reverse Voltage (DC): 20V; Series: -; RoHS Compliant: Yes; ComponentLink1URL: https://datasheet.ciiva.com/6378/cdbk0520l-hf-revb797958-6378223.pdf?src-supplier=Digi-Key; ComponentLink1Description: https://datasheet.ciiva.com/6378/cdbk0520l-hf-revb797958-6378223.pdf?src-supplier=Digi-Key
F1 = 1359: IC - FILTER, EMI 15A 50V 50KHZ-1GHZ SMD; Manufacturer Part Number: BNX026H01L; MFG: MURATA; MFG No: BNX026-01; Package: *; Power: *; Type: IC; Tolerance: *; Supplier 1: Newark; Supplier Part Number 1: 45Y4465; Supplier 2: Digi-Key; Supplier Part Number 2: 490-12523-1-ND; Status: Bronze; Supplier 3: Mouser; Supplier Part Number 3: 81-BNX026H01L; Manufacturer: Murata
J3 = 1-406541-7: Conn RJ-45 F 8 POS 1.02mm Solder RA Thru-Hole 10 Terminal 1 Port Cat 5 Box/Tray; Manufacturer: TE Connectivity; Number_of_Positions: 8; Centerline_Pitch: 1.02 mm[.04 in]; Value: *; Package: None; Manufacturer Part Number: 1-406541-7; Availability: Unavailable; TE_purchase_URL: https://www.te.com/usa-en/product-1-406507-5.html?te_bu=Cor&te_type=disp&te_campaign=seda_glo_cor-seda-global-disp-prtnr-fy19-seda-model-bom-cta_sma-317_1&elqCampaignId=32493; Price: None
J4 = CMP-03369-000080-1: CONN HEADER VERT 2POS 6.35MM; Manufacturer: TE Connectivity; Standoff Height: 0.63mm; Number Of Contacts: 2; Conn Gender: Male; Voltage Rating: 600V; Conn Orientation: Vertical; Current Rating: 12A; Number Of Rows: 1; Mouser Description: Connector, Soft Shell; Universal MATE-N-LOK; 2; Nylon; Natural; 19 A; 600 VAC; Height: 14.99mm; Pitch: 6.35mm; ComponentLink2URL: https://www.te.com/commerce/DocumentDelivery/DDEController?Action=showdoc&DocId=Customer+Drawing%7F350428%7FY2%7Fpdf%7FEnglish%7FENG_CD_350428_Y2.pdf%7F350428-1; Device Class L1: Connectors; Automotive: No; Octopart: https://octopart.com/350428-1-te+connectivity-46505355; Digikey Description: CONN HEADER VERT 2POS 6.35MM; RoHS: TRUE; Temperature: -40°C to +105°C; Contact Material: Gold,Nickel; Package: 350428-1; Temperature Range Low: -40°C; Device Class L3: unset; Lead Free: Yes; Device Class L2: Headers and Wire Housings; Category: Conn; ComponentLink2Description: Datasheet; Temperature Range High: +105°C; Manufacturer Part Number: 350428-1
L3 = XAL5030-332MEB: FIXED IND 8.2UH 4A 68 MOHM SMD; Manufacturer: Vishay Dale; Core Material: Metal,Composite; Tolerance: 20%; Self Resonant Frequency: 5MHz; Shielding: Shielded; Saturation Current: 7.5A; DC Resistance (DCR): 68mR; Test Frequency: 100kHz; Supplier: Digi-Key; Supplier Part Number: 541-1012-1-ND; RoHS: Yes; Category: Fixed Inductors; Stock: 44167; Pricing: 1=1.29000, 10=1.19500, 25=1.10280, 50=0.91920, 100=0.86400, 250=0.77204, 500=0.66176, 1000=0.58822 (USD); Mounting Technology: Surface Mount; Case/Package: 2525; Pins: 2; Case Code (Imperial): 2525; Min Operating Temperature: -55°C; Max Operating Temperature: 125°C; Value: 8.2uH; Packaging: Tape and Reel; Package Quantity: 2000; Current Rating: 4A; Inductance Tolerance: 20%; Max DC Current: 7.5A; Termination: SMD/SMT; RMS Current (Irms): 4A; Series: IHLP-2525CZ-01; Max Current Rating: 4A; Length: 6.86mm; Width: 6.47mm; Height: 3mm; Depth: 6.72mm; Radiation Hardening: No; Military Standard: Not; Lead Free: Lead Free; RoHS Compliant: Yes; Reach SVHC Compliant: Unknown; ComponentLink1URL: https://datasheet.ciiva.com/8017/lp25cz01-8017605.pdf?src-supplier=Element14; ComponentLink1Description: https://datasheet.ciiva.com/8017/lp25cz01-8017605.pdf?src-supplier=Element14; ComponentLink2URL: https://datasheet.ciiva.com/46393/1913191-46393003.pdf?src-supplier=Element14; ComponentLink2Description: https://datasheet.ciiva.com/46393/1913191-46393003.pdf?src-supplier=Element14; ComponentLink3URL: https://datasheet.ciiva.com/3081/lp25cz01-3081990.pdf?src-supplier=Avnet; ComponentLink3Description: https://datasheet.ciiva.com/3081/lp25cz01-3081990.pdf?src-supplier=Avnet; ComponentLink4URL: https://datasheet.ciiva.com/16348/lp25cz01-16348924.pdf?src-supplier=Future+Electronics; ComponentLink4Description: https://datasheet.ciiva.com/16348/lp25cz01-16348924.pdf?src-supplier=Future+Electronics
N2 N3 = Net Tie 10mil
Q1 Q3 = CSD19538Q2: 100-V, N channel NexFET™ power MOSFET, single SON 2 mm x 2 mm, 59 mOhm 6-WSON -55 to 150; Manufacturer: Texas Instruments; Manufacturer Part Number: CSD19538Q2T; Drain to Source Voltage (Vdss): 100V; Continuous Drain Current (ID): 13.1A; Rds On Max: 59mR; Input Capacitance: 454pF; Max Power Dissipation: 2.5W; Threshold Voltage: 3.2V; Supplier: Digi-Key; Supplier Part Number: 296-44612-1-ND; RoHS: Yes; Category: Integrated Circuits (ICs); Stock: 5766; Pricing: 1=1.11000, 10=0.99600, 100=0.77630 (USD); Mounting Technology: Surface Mount; Pins: 6; Min Operating Temperature: -55°C; Max Operating Temperature: 150°C; Packaging: Cut Tape; Element Configuration: Single; Series: NexFET™; Lead Free: Lead Free; RoHS Compliant: Yes; Reach SVHC Compliant: No; ComponentLink1URL: http://www.ti.com/general/docs/lit/getliterature.tsp?genericPartNumber=CSD19538Q2&fileType=pdf&src-supplier=Farnell; ComponentLink1Description: http://www.ti.com/general/docs/lit/getliterature.tsp?genericPartNumber=CSD19538Q2&fileType=pdf&src-supplier=Farnell; ComponentLink2URL: http://www.farnell.com/datasheets/2113485.pdf?src-supplier=Element14; ComponentLink2Description: http://www.farnell.com/datasheets/2113485.pdf?src-supplier=Element14; ComponentLink3URL: http://www.ti.com/lit/ds/symlink/csd19538q2.pdf?src-supplier=Digi-Key; ComponentLink3Description: http://www.ti.com/lit/ds/symlink/csd19538q2.pdf?src-supplier=Digi-Key
Q2 Q4 = CSD16301Q2: MOSFET N-CH 25V 6-SON; Manufacturer: Texas Instruments; Rise Time: 4.4ns; Rds On Max: 24mR; Continuous Drain Current (ID): 5A; Max Power Dissipation: 2.3W; Fall Time: 1.7ns; Gate to Source Voltage (Vgs): 10V; Drain to Source Resistance: 23mR; Turn-Off Delay Time: 4.1ns; Turn-On Delay Time: 2.7ns; Polarity: N-CHANNEL; Threshold Voltage: 1.2V; Input Capacitance: 340pF; Number of Elements: 1; Element Configuration: Single; Supplier: Digi-Key; Supplier Part Number: 296-25260-1-ND; Manufacturer Part Number: CSD16301Q2; RoHS: Yes; Category: MOSFETs; Stock: 25285; Pricing: 1=0.58000, 10=0.50000, 100=0.37360, 500=0.29350, 1000=0.22680 (USD); Mounting Technology: Surface Mount; Case/Package: SON; Pins: 6; Contact Plating: Tin,Matte; Min Operating Temperature: -55°C; Max Operating Temperature: 150°C; Package Quantity: 1; Packaging: Tape and Reel; Drain to Source Voltage (Vdss): 25V; Drain to Source Breakdown Voltage: 25V; Power Dissipation: 2.3W; Series: NexFET™; Nominal Vgs: 1.2V; Length: 2mm; Width: 2mm; Height: 0.8mm; Lead Free: Lead Free; RoHS Compliant: Yes; Reach SVHC Compliant: No; ComponentLink1URL: https://datasheet.ciiva.com/22698/1536215-22698017.pdf?src-supplier=Element14; ComponentLink1Description: https://datasheet.ciiva.com/22698/1536215-22698017.pdf?src-supplier=Element14; ComponentLink2URL: https://datasheet.ciiva.com/6388/csd16301q2-6388192.pdf?src-supplier=Digi-Key; ComponentLink2Description: https://datasheet.ciiva.com/6388/csd16301q2-6388192.pdf?src-supplier=Digi-Key; ComponentLink3URL: https://datasheet.ciiva.com/4438/slps235c-122185-4438227.pdf?src-supplier=Mouser; ComponentLink3Description: https://datasheet.ciiva.com/4438/slps235c-122185-4438227.pdf?src-supplier=Mouser; ComponentLink4URL: https://datasheet.ciiva.com/14192/slps235c-14192869.pdf?src-supplier=Avnet; ComponentLink4Description: https://datasheet.ciiva.com/14192/slps235c-14192869.pdf?src-supplier=Avnet; ComponentLink5URL: https://datasheet.ciiva.com/7968/1536215-7968247.pdf?src-supplier=Element14; ComponentLink5Description: https://datasheet.ciiva.com/7968/1536215-7968247.pdf?src-supplier=Element14; ComponentLink6URL: https://datasheet.ciiva.com/6388/csd16301q2-6388189.pdf?src-supplier=Digi-Key; ComponentLink6Description: https://datasheet.ciiva.com/6388/csd16301q2-6388189.pdf?src-supplier=Digi-Key
R27 = RES SMD 2K OHM 1% 1/10W 0603: Res Thick Film 0603 280K Ohm 1% 1/10W ±100ppm/°C Molded SMD SMD Paper T/R; Manufacturer: Vishay; Manufacturer Part Number: CRCW0603280KFKEA; Power Rating: 100mW; Voltage Rating: 75V; Supplier: Digi-Key; Supplier Part Number: 541-280KHCT-ND; RoHS: Yes; Category: Chip SMD Resistors; Stock: 5000; Pricing: 1=0.10000, 10=0.03400, 50=0.01860, 100=0.01370, 500=0.00836, 1000=0.00616 (USD); Case/Package: 0603; Pins: 2; Weight: 7.1E-05oz; Case Code (Imperial): 0603; Case Code (Metric): 1608; Contact Plating: Tin; Min Operating Temperature: -55°C; Max Operating Temperature: 155°C; Value: 280kR; Tolerance: 1%; Packaging: Tape and Reel; Package Quantity: 10; Termination: SMD/SMT; Number of Terminations: 2; Temperature Coefficient: 100ppm/°C; Max Power Dissipation: 100mW; Features: Automotive AEC-Q200; Series: CRCW; Resistor Type: Thick Film; Voltage Rating (DC): 75V; Technology: THICK FILM; Construction: Rectangular; Resistance Tolerance: 1%; Length: 1.55mm; Width: 0.033inch; Height: 0.45mm; Depth: 0.85mm; Ratings: AEC-Q200; Radiation Hardening: No; RoHS Compliant: Yes; Lead Free: Lead Free; Military Standard: Not; Reach SVHC Compliant: Unknown; ComponentLink1URL: https://datasheet.ciiva.com/3257/dcrcwe3-3257351.pdf?src-supplier=Avnet; ComponentLink1Description: https://datasheet.ciiva.com/3257/dcrcwe3-3257351.pdf?src-supplier=Avnet; ComponentLink2URL: https://datasheet.ciiva.com/2525/dcrcwe3-2525257.pdf?src-supplier=Digi-Key; ComponentLink2Description: https://datasheet.ciiva.com/2525/dcrcwe3-2525257.pdf?src-supplier=Digi-Key; ComponentLink3URL: https://datasheet.ciiva.com/2525/dcrcwe3-2525258.pdf?src-supplier=Digi-Key; ComponentLink3Description: https://datasheet.ciiva.com/2525/dcrcwe3-2525258.pdf?src-supplier=Digi-Key; ComponentLink4URL: https://datasheet.ciiva.com/2525/dcrcwe3-2525259.pdf?src-supplier=Digi-Key; ComponentLink4Description: https://datasheet.ciiva.com/2525/dcrcwe3-2525259.pdf?src-supplier=Digi-Key; ComponentLink5URL: https://datasheet.ciiva.com/5546/dcrcwe3-109170-5546469.pdf?src-supplier=Mouser; ComponentLink5Description: https://datasheet.ciiva.com/5546/dcrcwe3-109170-5546469.pdf?src-supplier=Mouser; ComponentLink6URL: https://datasheet.ciiva.com/16211/dcrcwe3-16211915.pdf?src-supplier=Future+Electronics; ComponentLink6Description: https://datasheet.ciiva.com/16211/dcrcwe3-16211915.pdf?src-supplier=Future+Electronics; ComponentLink7URL: https://datasheet.ciiva.com/16764/70201119-16764262.pdf?src-supplier=Allied+Electronics; ComponentLink7Description: https://datasheet.ciiva.com/16764/70201119-16764262.pdf?src-supplier=Allied+Electronics; ComponentLink8URL: https://datasheet.ciiva.com/15225/getdatasheetpartid-32838-15225341.pdf?src-supplier=Verical; ComponentLink8Description: https://datasheet.ciiva.com/15225/getdatasheetpartid-32838-15225341.pdf?src-supplier=Verical; ComponentLink9URL: https://datasheet.ciiva.com/7673/1697337-7673461.pdf?src-supplier=Element14; ComponentLink9Description: https://datasheet.ciiva.com/7673/1697337-7673461.pdf?src-supplier=Element14
R28 = RES SMD 2K OHM 1% 1/10W 0603: Res General Purpose Thick Film 0603 20K Ohm 1% 1/10W ±100ppm/°C Molded SMD Paper T/R; Manufacturer: Yageo; Manufacturer Part Number: RC0603FR-0720KL; Voltage Rating (DC): 50V; Power Rating: 100mW; Supplier: Digi-Key; Supplier Part Number: 311-20.0KHRCT-ND; RoHS: Yes; Category: Chip SMD Resistors; Stock: 7108334; Pricing: 1=0.10000, 10=0.01900, 50=0.01140, 100=0.00940, 500=0.00628, 1000=0.00537 (USD); Case/Package: 0603; Pins: 2; Case Code (Imperial): 0603; Case Code (Metric): 1608; Min Operating Temperature: -55°C; Max Operating Temperature: 155°C; Tolerance: 1%; Packaging: Tape and Reel; Value: 20kR; Resistor Type: Thick Film; Temperature Coefficient: 100ppm/°C; Voltage Rating: 50V; Package Quantity: 1; Termination: SMD/SMT; Number of Terminations: 2; Max Power Dissipation: 100mW; Features: Moisture Resistant; Series: RC; Technology: THICK FILM; Construction: Rectangular; Resistance Tolerance: 1%; Length: 0.063inch; Width: 0.031inch; Height: 0.022inch; Depth: 0.8mm; Lead Free: Lead Free; RoHS Compliant: Yes; Reach SVHC Compliant: No; Military Standard: Not; ComponentLink1URL: https://datasheet.ciiva.com/11808/0900766b80f96399-11808275.pdf?src-supplier=Rs; ComponentLink1Description: https://datasheet.ciiva.com/11808/0900766b80f96399-11808275.pdf?src-supplier=Rs; ComponentLink2URL: https://datasheet.ciiva.com/22747/443971-22747525.pdf?src-supplier=Element14; ComponentLink2Description: https://datasheet.ciiva.com/22747/443971-22747525.pdf?src-supplier=Element14; ComponentLink3URL: https://datasheet.ciiva.com/2453/pyu-r-int-thick-7-2453911.pdf?src-supplier=Digi-Key; ComponentLink3Description: https://datasheet.ciiva.com/2453/pyu-r-int-thick-7-2453911.pdf?src-supplier=Digi-Key; ComponentLink4URL: https://datasheet.ciiva.com/2453/pyu-r-int-thick-7-2453912.pdf?src-supplier=Digi-Key; ComponentLink4Description: https://datasheet.ciiva.com/2453/pyu-r-int-thick-7-2453912.pdf?src-supplier=Digi-Key; ComponentLink5URL: https://datasheet.ciiva.com/2453/pyu-r-int-thick-7-2453910.pdf?src-supplier=Digi-Key; ComponentLink5Description: https://datasheet.ciiva.com/2453/pyu-r-int-thick-7-2453910.pdf?src-supplier=Digi-Key
R29 = RES 249K OHM 1% 1/20W 0201: Res Thick Film 0201 249K Ohm 1% 1/20W ±200ppm/°C Molded SMD Paper T/R; Manufacturer: Yageo; Manufacturer Part Number: RC0201FR-07249KL; Max Power Dissipation: 50mW; Supplier: Digi-Key; Supplier Part Number: YAG2335CT-ND; RoHS: Yes; Category: Chip SMD Resistors; Stock: 559615; Pricing: 1=0.10000, 10=0.02700, 50=0.01720, 100=0.01450, 500=0.00998, 1000=0.00863, 5000=0.00635 (USD); Case/Package: 0201; Case Code (Metric): 0603; Case Code (Imperial): 0201; Min Operating Temperature: -55°C; Max Operating Temperature: 125°C; Package Quantity: 10000; Packaging: Tape and Reel; Value: 249kR; Tolerance: 1%; Number of Terminations: 2; Temperature Coefficient: 200ppm/°C; Features: Moisture Resistant; Series: RC0201; Length: 0.024inch; Width: 0.012inch; Height: 0.01inch; RoHS Compliant: Yes; ComponentLink1URL: https://datasheet.ciiva.com/14985/pyu-r-int-thick-7-14985449.pdf?src-supplier=Digi-Key; ComponentLink1Description: https://datasheet.ciiva.com/14985/pyu-r-int-thick-7-14985449.pdf?src-supplier=Digi-Key
R30 = RES SMD 48.7K OHM 1% 1/16W 0402: Res Thick Film 0402 48.7K Ohm 1% 1/16W ±100ppm/°C Molded SMD SMD Paper T/R; Manufacturer: Vishay; Manufacturer Part Number: CRCW040248K7FKED; Power Rating: 63mW; Voltage Rating: 50V; Supplier: Digi-Key; Supplier Part Number: 541-48.7KLCT-ND; RoHS: Yes; Category: Chip SMD Resistors; Stock: 10000; Pricing: 1=0.10000, 10=0.03300, 50=0.01820, 100=0.01340, 500=0.00818, 1000=0.00602, 5000=0.00432 (USD); Case/Package: 0402; Pins: 2; Contact Plating: Tin; Weight: 2.3E-05oz; Case Code (Imperial): 0402; Case Code (Metric): 1005; Min Operating Temperature: -55°C; Max Operating Temperature: 155°C; Value: 48.7kR; Tolerance: 1%; Packaging: Tape and Reel; Temperature Coefficient: 100ppm/°C; Package Quantity: 10; Termination: SMD/SMT; Number of Terminations: 2; Max Power Dissipation: 63mW; Features: Automotive AEC-Q200; Series: CRCW; Resistor Type: Thick Film; Technology: THICK FILM; Resistance Tolerance: 1%; Length: 1mm; Width: 0.02inch; Height: 0.35mm; Depth: 0.5mm; Radiation Hardening: No; RoHS Compliant: Yes; Reach SVHC Compliant: Unknown; ComponentLink1URL: https://datasheet.ciiva.com/3256/dcrcwe3-3256571.pdf?src-supplier=Avnet; ComponentLink1Description: https://datasheet.ciiva.com/3256/dcrcwe3-3256571.pdf?src-supplier=Avnet; ComponentLink2URL: https://datasheet.ciiva.com/2464/dcrcwe3-2464540.pdf?src-supplier=Digi-Key; ComponentLink2Description: https://datasheet.ciiva.com/2464/dcrcwe3-2464540.pdf?src-supplier=Digi-Key; ComponentLink3URL: https://datasheet.ciiva.com/2464/dcrcwe3-2464541.pdf?src-supplier=Digi-Key; ComponentLink3Description: https://datasheet.ciiva.com/2464/dcrcwe3-2464541.pdf?src-supplier=Digi-Key; ComponentLink4URL: https://datasheet.ciiva.com/2464/dcrcwe3-2464542.pdf?src-supplier=Digi-Key; ComponentLink4Description: https://datasheet.ciiva.com/2464/dcrcwe3-2464542.pdf?src-supplier=Digi-Key; ComponentLink5URL: https://datasheet.ciiva.com/5545/dcrcwe3-109170-5545210.pdf?src-supplier=Mouser; ComponentLink5Description: https://datasheet.ciiva.com/5545/dcrcwe3-109170-5545210.pdf?src-supplier=Mouser; ComponentLink6URL: https://datasheet.ciiva.com/16436/dcrcwe3-16436139.pdf?src-supplier=Future+Electronics; ComponentLink6Description: https://datasheet.ciiva.com/16436/dcrcwe3-16436139.pdf?src-supplier=Future+Electronics